# Altium schematic sheet cpu.SchDoc
size A3
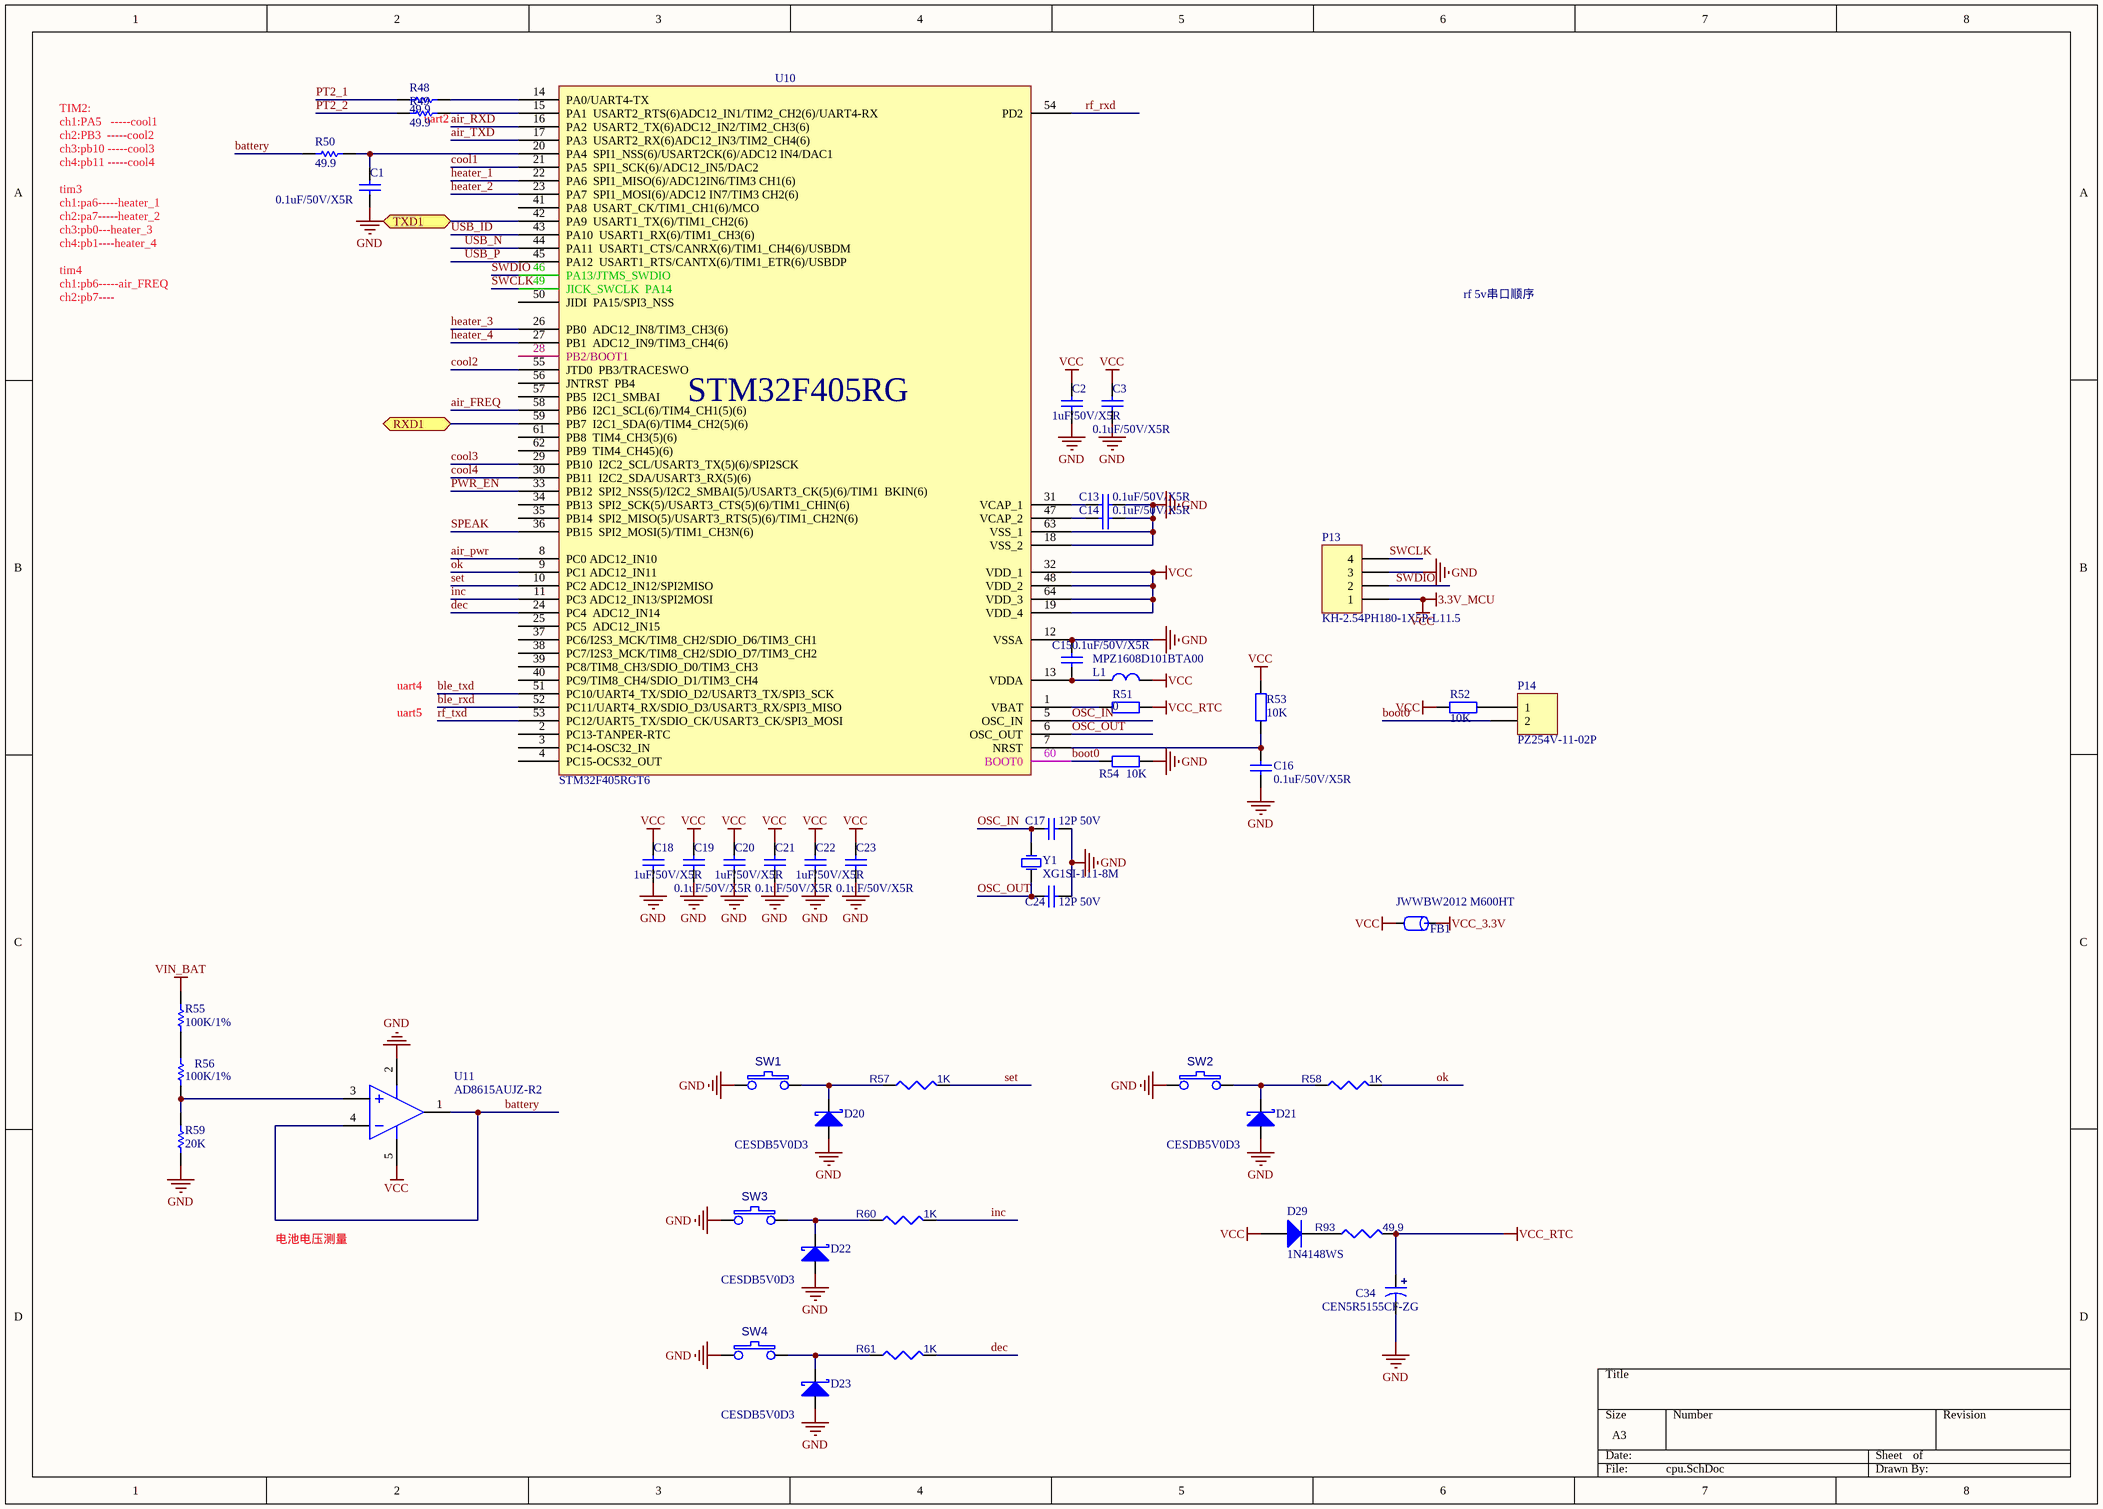
[diagram p0: cpu.SchDoc]

## Parts
C1  0.1uF/50V/X5R  [0603C]
C2  1uF/50V/X5R  [0603C]
C3  0.1uF/50V/X5R  [0603C]
C13  0.1uF/50V/X5R  [0603C]
C14  0.1uF/50V/X5R  [0603C]
C15  0.1uF/50V/X5R  [0603C]
C16  0.1uF/50V/X5R  [0603C]
C17  12P 50V  [0603C]
C18  1uF/50V/X5R  [0603C]
C19  0.1uF/50V/X5R  [0603C]
C20  1uF/50V/X5R  [0603C]
C21  0.1uF/50V/X5R  [0603C]
C22  1uF/50V/X5R  [0603C]
C23  0.1uF/50V/X5R  [0603C]
C24  12P 50V  [0603C]
C34  CEN5R5155CF-ZG  [CAP-TH_BD21.0-P5.00-D0.8_CENXXX-CF]
D20  CESDB5V0D3  [SOD323]
D21  CESDB5V0D3  [SOD323]
D22  CESDB5V0D3  [SOD323]
D23  CESDB5V0D3  [SOD323]
D29  1N4148WS  [SOD323]
FB1  JWWBW2012 M600HT  [0805CZ]
L1  MPZ1608D101BTA00  [0603R]
P13  KH-2.54PH180-1X5P-L11.5  [HDR1X4]
P14  PZ254V-11-02P  [HDR1X2]
R48  49.9  [0603R]
R49  49.9  [0603R]
R50  49.9  [0603R]
R51  0  [0603R]
R52  10K  [0603R]
R53  10K  [0603R]
R54  10K  [0603R]
R55  100K/1%  [0603R]
R56  100K/1%  [0603R]
R57  value 1K  [0603R]  (hidden comment: 1k/1%)
R58  value 1K  [0603R]  (hidden comment: 1k/1%)
R59  20K  [0603R]
R60  value 1K  [0603R]  (hidden comment: 1k/1%)
R61  value 1K  [0603R]  (hidden comment: 1k/1%)
R93  value 49.9  [0603R]  (hidden comment: 1k/1%)
SW1  TS-1088-AR02016  [SW-SMD_L3.9-W3.0-P4.45]  (value not drawn)
SW2  TS-1088-AR02016  [SW-SMD_L3.9-W3.0-P4.45]  (value not drawn)
SW3  TS-1088-AR02016  [SW-SMD_L3.9-W3.0-P4.45]  (value not drawn)
SW4  TS-1088-AR02016  [SW-SMD_L3.9-W3.0-P4.45]  (value not drawn)
U10  STM32F405RGT6  [LQFP-64]
U11  AD8615AUJZ-R2  [sot-23-5]
Y1  XG1SI-111-8M  [CRAY_5032]

## Ports
RXD1 (bidir), TXD1 (bidir)

## Nets
3.3V_MCU: C2.2 C3.2 C18.2 C19.2 C20.2 C21.2 C22.2 C23.2 D29.1(A) FB1.2 L1.2 P13.1 R52.2 R53.1 U10.19(VDD_4) U10.32(VDD_1) U10.48(VDD_2) U10.64(VDD_3) U11.5(VCC)  [also labelled VCC]
GND: C1.1 C2.1 C3.1 C13.1 C14.1 C15.1 C16.1 C17.1 C18.1 C19.1 C20.1 C21.1 C22.1 C23.1 C24.1 C34.2 D20.1(A) D21.1(A) D22.1(A) D23.1(A) P13.3 R54.2 R59.2 SW1.1 SW2.1 SW3.1 SW4.1 U10.12(VSSA) U10.18(VSS_2) U10.63(VSS_1) U11.2(G)
VCC_3.3V: FB1.1
VCC_RTC: C34.1 R51.1 R93.2
VIN_BAT: R55.1
air_FREQ: U10.58(PB6__I2C1_SCL(6)/TIM4_CH1(5)(6))
air_pwr: U10.8(PC0_ADC12_IN10)
air_RXD: U10.16(PA2__USART2_TX(6)ADC12_IN2/TIM2_CH3(6))
air_TXD: U10.17(PA3__USART2_RX(6)ADC12_IN3/TIM2_CH4(6))
battery: R50.1 U11.1(OS_NUL) U11.4(V-)
ble_rxd: U10.52(PC11/UART4_RX/SDIO_D3/USART3_RX/SPI3_MISO)
ble_txd: U10.51(PC10/UART4_TX/SDIO_D2/USART3_TX/SPI3_SCK)
boot0: P14.2 R54.1 U10.60(BOOT0)
cool1: U10.21(PA5__SPI1_SCK(6)/ADC12_IN5/DAC2)
cool2: U10.55(JTD0__PB3/TRACESWO)
cool3: U10.29(PB10__I2C2_SCL/USART3_TX(5)(6)/SPI2SCK)
cool4: U10.30(PB11__I2C2_SDA/USART3_RX(5)(6))
dec: R61.2 U10.24(PC4__ADC12_IN14)
heater_1: U10.22(PA6__SPI1_MISO(6)/ADC12IN6/TIM3_CH1(6))
heater_2: U10.23(PA7__SPI1_MOSI(6)/ADC12_IN7/TIM3_CH2(6))
heater_3: U10.26(PB0__ADC12_IN8/TIM3_CH3(6))
heater_4: U10.27(PB1__ADC12_IN9/TIM3_CH4(6))
inc: R60.2 U10.11(PC3_ADC12_IN13/SPI2MOSI)
ok: R58.2 U10.9(PC1_ADC12_IN11)
OSC_IN: C17.2 U10.5(OSC_IN) Y1.2(OSC2)
OSC_OUT: C24.2 U10.6(OSC_OUT) Y1.1(OSC1)
PT2_1: R48.1
PT2_2: R49.1
PWR_EN: U10.33(PB12__SPI2_NSS(5)/I2C2_SMBAI(5)/USART3_CK(5)(6)/TIM1__BKIN(6))
rf_rxd: U10.54(PD2)
rf_txd: U10.53(PC12/UART5_TX/SDIO_CK/USART3_CK/SPI3_MOSI)
RXD1: U10.59(PB7__I2C1_SDA(6)/TIM4_CH2(5)(6)) ; port RXD1
set: R57.2 U10.10(PC2_ADC12_IN12/SPI2MISO)
SPEAK: U10.36(PB15__SPI2_MOSI(5)/TIM1_CH3N(6))
SWCLK: P13.4 U10.49(JICK_SWCLK__PA14)
SWDIO: P13.2 U10.46(PA13/JTMS_SWDIO)
TXD1: U10.42(PA9__USART1_TX(6)/TIM1_CH2(6)) ; port TXD1
USB_ID: U10.43(PA10__USART1_RX(6)/TIM1_CH3(6))
USB_N: U10.44(PA11__USART1_CTS/CANRX(6)/TIM1_CH4(6)/USBDM)
USB_P: U10.45(PA12__USART1_RTS/CANTX(6)/TIM1_ETR(6)/USBDP)
NetC1_2: C1.2 R50.2 U10.20(PA4__SPI1_NSS(6)/USART2CK(6)/ADC12_IN4/DAC1)
NetC13_2: C13.2 U10.31(VCAP_1)
NetC14_2: C14.2 U10.47(VCAP_2)
NetC15_2: C15.2 L1.1 U10.13(VDDA)
NetC16_2: C16.2 R53.2 U10.7(NRST)
NetD20_2: D20.2(K) R57.1 SW1.2
NetD21_2: D21.2(K) R58.1 SW2.2
NetD22_2: D22.2(K) R60.1 SW3.2
NetD23_2: D23.2(K) R61.1 SW4.2
NetD29_2: D29.2(K) R93.1
NetP14_1: P14.1 R52.1
NetR48_2: R48.2 U10.14(PA0/UART4-TX)
NetR49_2: R49.2 U10.15(PA1__USART2_RTS(6)ADC12_IN1/TIM2_CH2(6)/UART4-RX)
NetR51_2: R51.2 U10.1(VBAT)
NetR55_2: R55.2 R56.1
NetR56_2: R56.2 R59.1 U11.3(V+)

Not connected (* = marked no-connect by the designer): U10 2(PC13-TANPER-RTC) 3(PC14-OSC32_IN) 4(PC15-OCS32_OUT) 25(PC5__ADC12_IN15) 28(PB2/BOOT1) 34(PB13__SPI2_SCK(5)/USART3_CTS(5)(6)/TIM1_CHIN(6)) 35(PB14__SPI2_MISO(5)/USART3_RTS(5)(6)/TIM1_CH2N(6)) 37(PC6/I2S3_MCK/TIM8_CH2/SDIO_D6/TIM3_CH1) 38(PC7/I2S3_MCK/TIM8_CH2/SDIO_D7/TIM3_CH2) 39(PC8/TIM8_CH3/SDIO_D0/TIM3_CH3) 40(PC9/TIM8_CH4/SDIO_D1/TIM3_CH4) 41(PA8__USART_CK/TIM1_CH1(6)/MCO) 50(JIDI__PA15/SPI3_NSS) 56(JNTRST__PB4) 57(PB5__I2C1_SMBAI) 61(PB8__TIM4_CH3(5)(6)) 62(PB9__TIM4_CH45)(6))

## Notes on the sheet
- (near R49) uart2
- TIM2:
  ch1:PA5   -----cool1
  ch2:PB3  -----cool2
  ch3:pb10 -----cool3
  ch4:pb11 -----cool4
  tim3
  ch1:pa6-----heater_1
  ch2:pa7-----heater_2
  ch3:pb0---heater_3
  ch4:pb1----heater_4
  tim4
  ch1:pb6-----air_FREQ
  ch2:pb7----
- rf 5v串口顺序
- uart4
- uart5
- 电池电压测量

## Library data of the parts
C1-C3 C13-C24 = CAP4: 贴片电容 20%
C34 = CAP2: 电解电容
D20-D23 = DIODE S: Schottky Diode
D29 = DIODE
FB1 = FB: Part Field 1: 磁珠/0603/1K ohm/100MHz; Text Field1: FB; Value: JWWBW2012 M600HT
L1 = CIZHU1: 磁珠电感 100R 100MHz
P13 = Header 4: Header, 4-Pin; LatestRevisionDate: 17-Jul-2002; LatestRevisionNote: Re-released for DXP Platform.; Publisher: Altium Limited
P14 = Header 2: Header, 2-Pin; LatestRevisionDate: 17-Jul-2002; LatestRevisionNote: Re-released for DXP Platform.; Publisher: Altium Limited
R48-R50 R55 R56 R59 = Res1: Resistor; Published: 8-Jun-2000; LatestRevisionDate: 17-Jul-2002; LatestRevisionNote: Re-released for DXP Platform.; PackageReference: AXIAL-0.3; Publisher: Altium Limited
R51-R54 = RES2: 贴片电阻 5%
R57 R58 R60 R61 R93 = RESISTOR_0: Part Reference: R70; SIGNAL_MODEL: DEFAULT_RESISTOR_200OHM_1_2; PCB Footprint: R0402
SW1-SW4 = SW PUSHBUTTON: Part Reference: SW2; PCB Footprint: KEY_3X6
  SW1: Value: TS-1088-AR02016
  SW2-SW4: Value: SW PUSHBUTTON
U10 = STM32F405RG: MCU
U11 = AD8615
Y1 = XTAL: 晶振